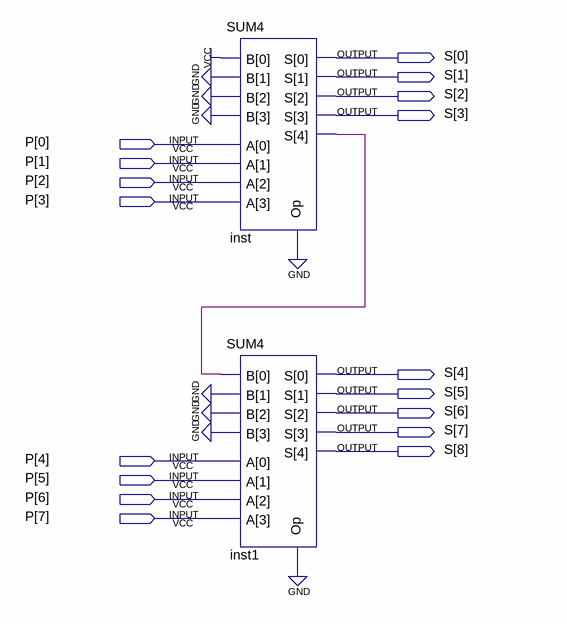
[diagram p0: schematic sheet]
// Quartus schematic SUM8.bdf as structural Verilog: 2 symbols, 17 pins
module SUM8 (
  input  [7:0] P,
  output [8:0] S
);

  wire inst_s;

  SUM4 inst (.B(4'b0001), .Op(1'b0), .A(P[3:0]), .S({inst_s, S[3:0]}));
  SUM4 inst1 (.B({3'b000, inst_s}), .Op(1'b0), .A(P[7:4]), .S(S[8:4]));
endmodule
